# EAGLE design Attiny bot (EAGLE 7.2.0)
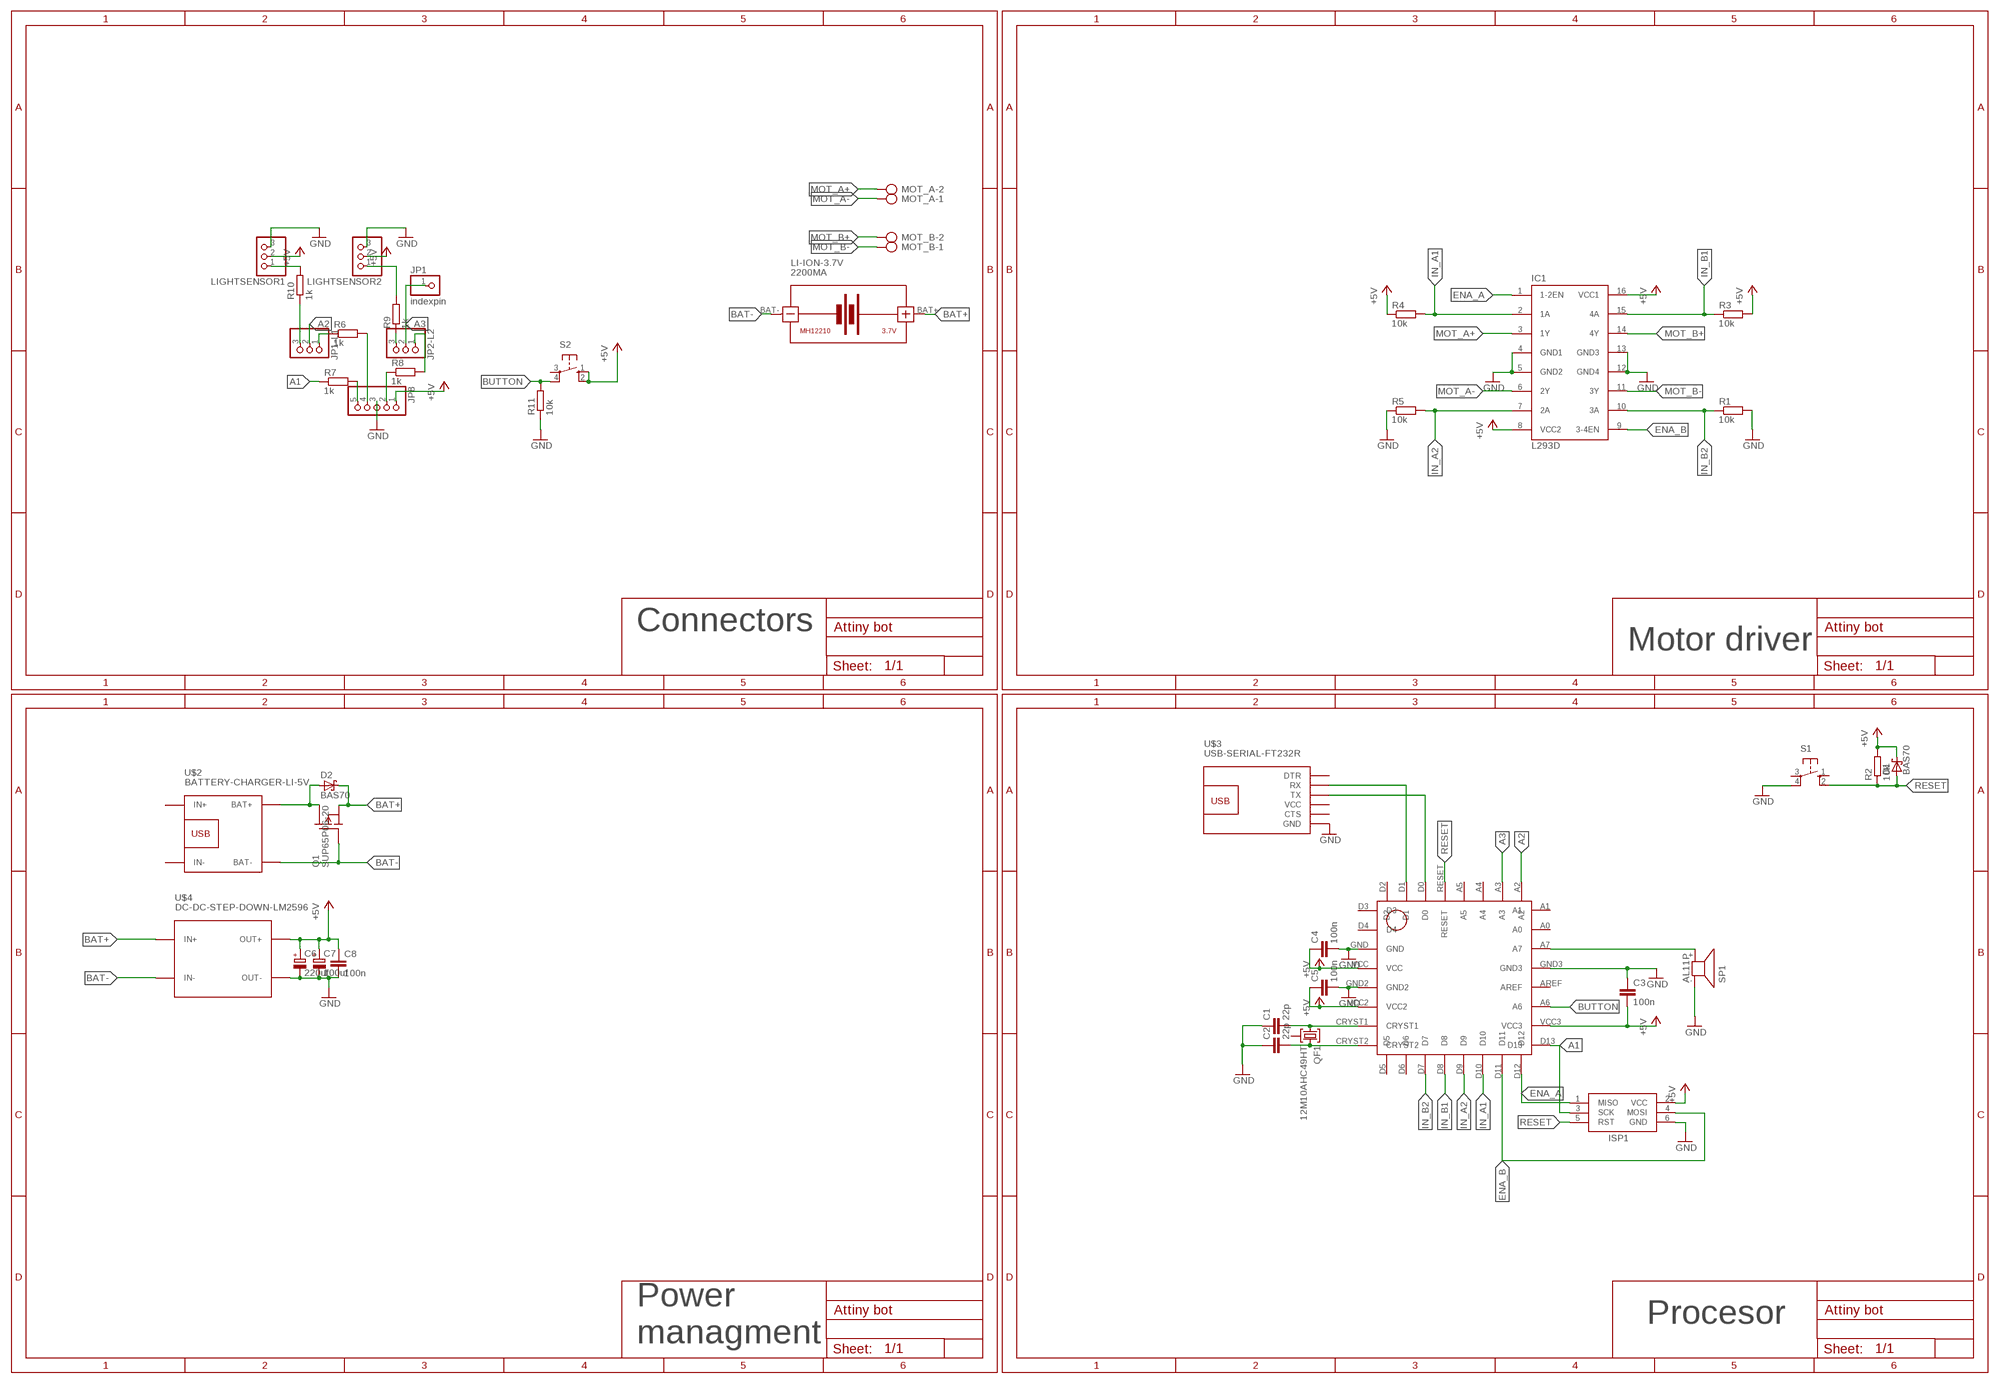
[diagram p0: schematic, sheet 1]

## Parts
C1  22p  C-EUC1206  [C1206]
C2  22p  C-EUC1206  [C1206]
C3  100n  C-EUC1206  [C1206]
C4  100n  C-EUC1206  [C1206]
C5  100n  C-EUC1206  [C1206]
C6  220uf  CPOL-EUE3.5-8  [E3,5-8]
C7  100uf  CPOL-EUE3.5-8  [E3,5-8]
C8  100n  C-EUC1206  [C1206]
D1  BAS70  [SOT23]
D2  BAS70  [SOT23]
IC1  L293D  [DIL16]
ISP1  AVRISP-6  [AVRISP]
JP1  indexpin  PINHD-1X1  [1X01]
JP1-L1  PINHD-1X3  [1X03]
JP2-L2  PINHD-1X3  [1X03]
JP8  PINHD-1X5  [1X05]
LI-ION-3.7V  2200MA  BATTERY-LI-MH12210  [BATTERY-LI-MH12210]
LIGHTSENSOR1  PINHD-1X3  [1X03]
LIGHTSENSOR2  PINHD-1X3  [1X03]
MOT_A  AK500/2  [AK500/2]
MOT_B  AK500/2  [AK500/2]
Q1  SUP65P06-20  [TO220]
QF1  12M10AHC49HT  [HC49U]
R1  10k  R-EU_R1206  [R1206]
R2  10k  R-EU_R1206  [R1206]
R3  10k  R-EU_R1206  [R1206]
R4  10k  R-EU_R1206  [R1206]
R5  10k  R-EU_R1206  [R1206]
R6  1k  R-EU_R1206  [R1206]
R7  1k  R-EU_R1206  [R1206]
R8  1k  R-EU_R1206  [R1206]
R9  1k  R-EU_R1206  [R1206]
R10  1k  R-EU_R1206  [R1206]
R11  10k  R-EU_R1206  [R1206]
S1  10-XX  [B3F-10XX]
S2  10-XX  [B3F-10XX]
SP1  AL11P  [AL11P]
U$1  PROCESSOR  [PROCESOR]
U$2  BATTERY-CHARGER-LI-5V  [BATTERY-CHARGER-LI-5V]
U$3  USB-SERIAL-FT232R  [USB-SERIAL-FT232R]
U$4  DC-DC-STEP-DOWN-LM2596  [DC-DC-STEP-DOWN-LM2596]

## Nets
+5V: C3.2 C4.1 C5.1 C6.+ C7.+ C8.1 D1.3(C) IC1.8(VCC2) IC1.16(VCC1) ISP1.2(VCC) JP8.1 LIGHTSENSOR1.2 LIGHTSENSOR2.2 R2.2 R3.2 R4.1 S2.1(S) S2.2(S1) U$1.VCC U$1.VCC2 U$1.VCC3 U$4.OUT+
A1: ISP1.3(SCK) R7.1 U$1.D13
A2: JP1-L1.2 U$1.A2
A3: JP1.1 JP2-L2.2 U$1.A3
BAT+: D2.3(C) LI-ION-3.7V.BAT+ Q1.3(S) U$4.IN+
BAT-: LI-ION-3.7V.BAT- Q1.1(G) U$2.BAT- U$4.IN-
BUTTON: R11.2 S2.4(P1) U$1.A6
ENA_A: IC1.1(1-2EN) ISP1.1(MISO) U$1.D12
ENA_B: IC1.9(3-4EN) ISP1.4(MOSI) U$1.D11
GND: C1.1 C2.1 C3.1 C4.2 C5.2 C6.- C7.- C8.2 IC1.4(GND1) IC1.5(GND2) IC1.12(GND4) IC1.13(GND3) ISP1.6(GND) JP8.3 LIGHTSENSOR1.3 LIGHTSENSOR2.3 R1.2 R5.1 R11.1 S1.4(P1) SP1.- U$1.GND U$1.GND2 U$1.GND3 U$3.6(GND) U$4.OUT-
IN_A1: IC1.2(1A) R4.2 U$1.D10
IN_A2: IC1.7(2A) R5.2 U$1.D9
IN_B1: IC1.15(4A) R3.1 U$1.D8
IN_B2: IC1.10(3A) R1.1 U$1.D7
MOT_A+: IC1.3(1Y) MOT_A.2
MOT_A-: IC1.6(2Y) MOT_A.1
MOT_B+: IC1.14(4Y) MOT_B.2
MOT_B-: IC1.11(3Y) MOT_B.1
N$1: JP1-L1.1 R6.1
N$2: JP8.2 R8.1
N$3: C2.2 QF1.3 U$1.CRYST2
N$4: C1.2 QF1.1 U$1.CRYST1
N$6: LIGHTSENSOR2.1 R9.2
N$7: U$1.D1 U$3.2(RX)
N$8: LIGHTSENSOR1.1 R10.2
N$9: JP2-L2.3 R9.1
N$10: JP8.5 R7.2
N$11: JP8.4 R6.2
N$12: JP2-L2.1 R8.2
N$13: JP1-L1.3 R10.1
N$14: D2.1(A) Q1.2(D) U$2.BAT+
N$15: SP1.+ U$1.A7
N$16: U$1.D0 U$3.3(TX)
RESET: D1.1(A) ISP1.5(RST) R2.1 S1.2(S1) U$1.RESET
Unconnected: QF1.2 S1.1(S) S1.3(P) S2.3(P) U$1.A0 U$1.A1 U$1.A4 U$1.A5 U$1.AREF U$1.D2 U$1.D3 U$1.D4 U$1.D5 U$1.D6 U$2.IN+ U$2.IN- U$3.1(DTR) U$3.5(CTS)

## Notes on the sheet
- Connectors
- Motor driver
- Procesor
- Power
  managment

## Power pins joined to a net without a drawn wire
VCC: U$3.4(VCC)

## Library data of the parts
C1-C5 C8 = rcl:C-EU: CAPACITOR, European symbol
C6 C7 = rcl:CPOL-EU: POLARIZED CAPACITOR, European symbol
D1 D2 = diode:BAS70: Silicon Schottky Diodes General-purpose diode for high-speed switching
IC1 = st-microelectronics:L293D: PUSH-PULL 4 CHANNEL DRIVER; MPN: L293D; OC_FARNELL: 9589619; OC_NEWARK: 56P8249
ISP1 = adafruit:AVRISP: AVR ISP HEADER Standard 6 pin header for AVR programming
JP1 = pinhead:PINHD-1X1: PIN HEADER
JP1-L1 JP2-L2 LIGHTSENSOR1 LIGHTSENSOR2 = pinhead:PINHD-1X3: PIN HEADER
JP8 = pinhead:PINHD-1X5: PIN HEADER
LI-ION-3.7V = diy-modules:BATTERY-LI-MH12210: Lithium-Ion MH12210 Rechargeable Battery Panasonic NCR18650PF battery datasheet available here: https://industrial.panasonic.com/cdbs/www-data/pdf2/ACI4000/ACI4000C12.pdf Click here to find device on ebay.com <http://www.ebay.com/sch/ncr18650b+battery>
MOT_A MOT_B = con-ptr500:AK500/2: CONNECTOR; OC_FARNELL: unknown; OC_NEWARK: unknown
Q1 = transistor-fet+irf7201:SUP65P06-20: P-Channel Enhancement MOSFET -60V; 60A; 0,020Ohm
QF1 = crystal:12M10AHC49HT: Monolithic Crystal Filters Source: www.vanlong.com; OC_FARNELL: unknown; OC_NEWARK: unknown
R1-R11 = rcl:R-EU_: RESISTOR, European symbol
S1 S2 = switch-omron:10-XX: OMRON SWITCH; MPN: B3F-1000; OC_FARNELL: 176432; OC_NEWARK: 36M3542
SP1 = buzzer:AL11P: SPEAKER Source: Buerklin; OC_FARNELL: unknown; OC_NEWARK: unknown
U$1 = PROCESSOR:PROCESSOR
U$2 = diy-modules:BATTERY-CHARGER-LI-5V: Lithium Battery 5V Charger More details available here: http://www.buildcircuit.com/how-to-use-micro-usb-5v-1a-lithium-battery-charging-board-charger-module/ Click here to find device on ebay.com <http://www.ebay.com/sch/tp4056+charger+usb>
U$3 = diy-modules:USB-SERIAL-FT232R: USB to Serial UART Converter based on FT232R chip More information about FT232R chip is available here: http://www.ftdichip.com/Products/ICs/FT232R.htm Click here to find device on ebay.com <http://www.ebay.com/sch/ft232rl+arduino+download+max232>
U$4 = diy-modules:DC-DC-STEP-DOWN-LM2596: DC/DC Step-Down Regulator based on LM2596-ADJ chip LM2596 datasheet available here: http://www.ti.com/lit/ds/symlink/lm2596.pdf Click here to find device on ebay.com <http://www.ebay.com/sch/lm2596+power+regulator>

## Board
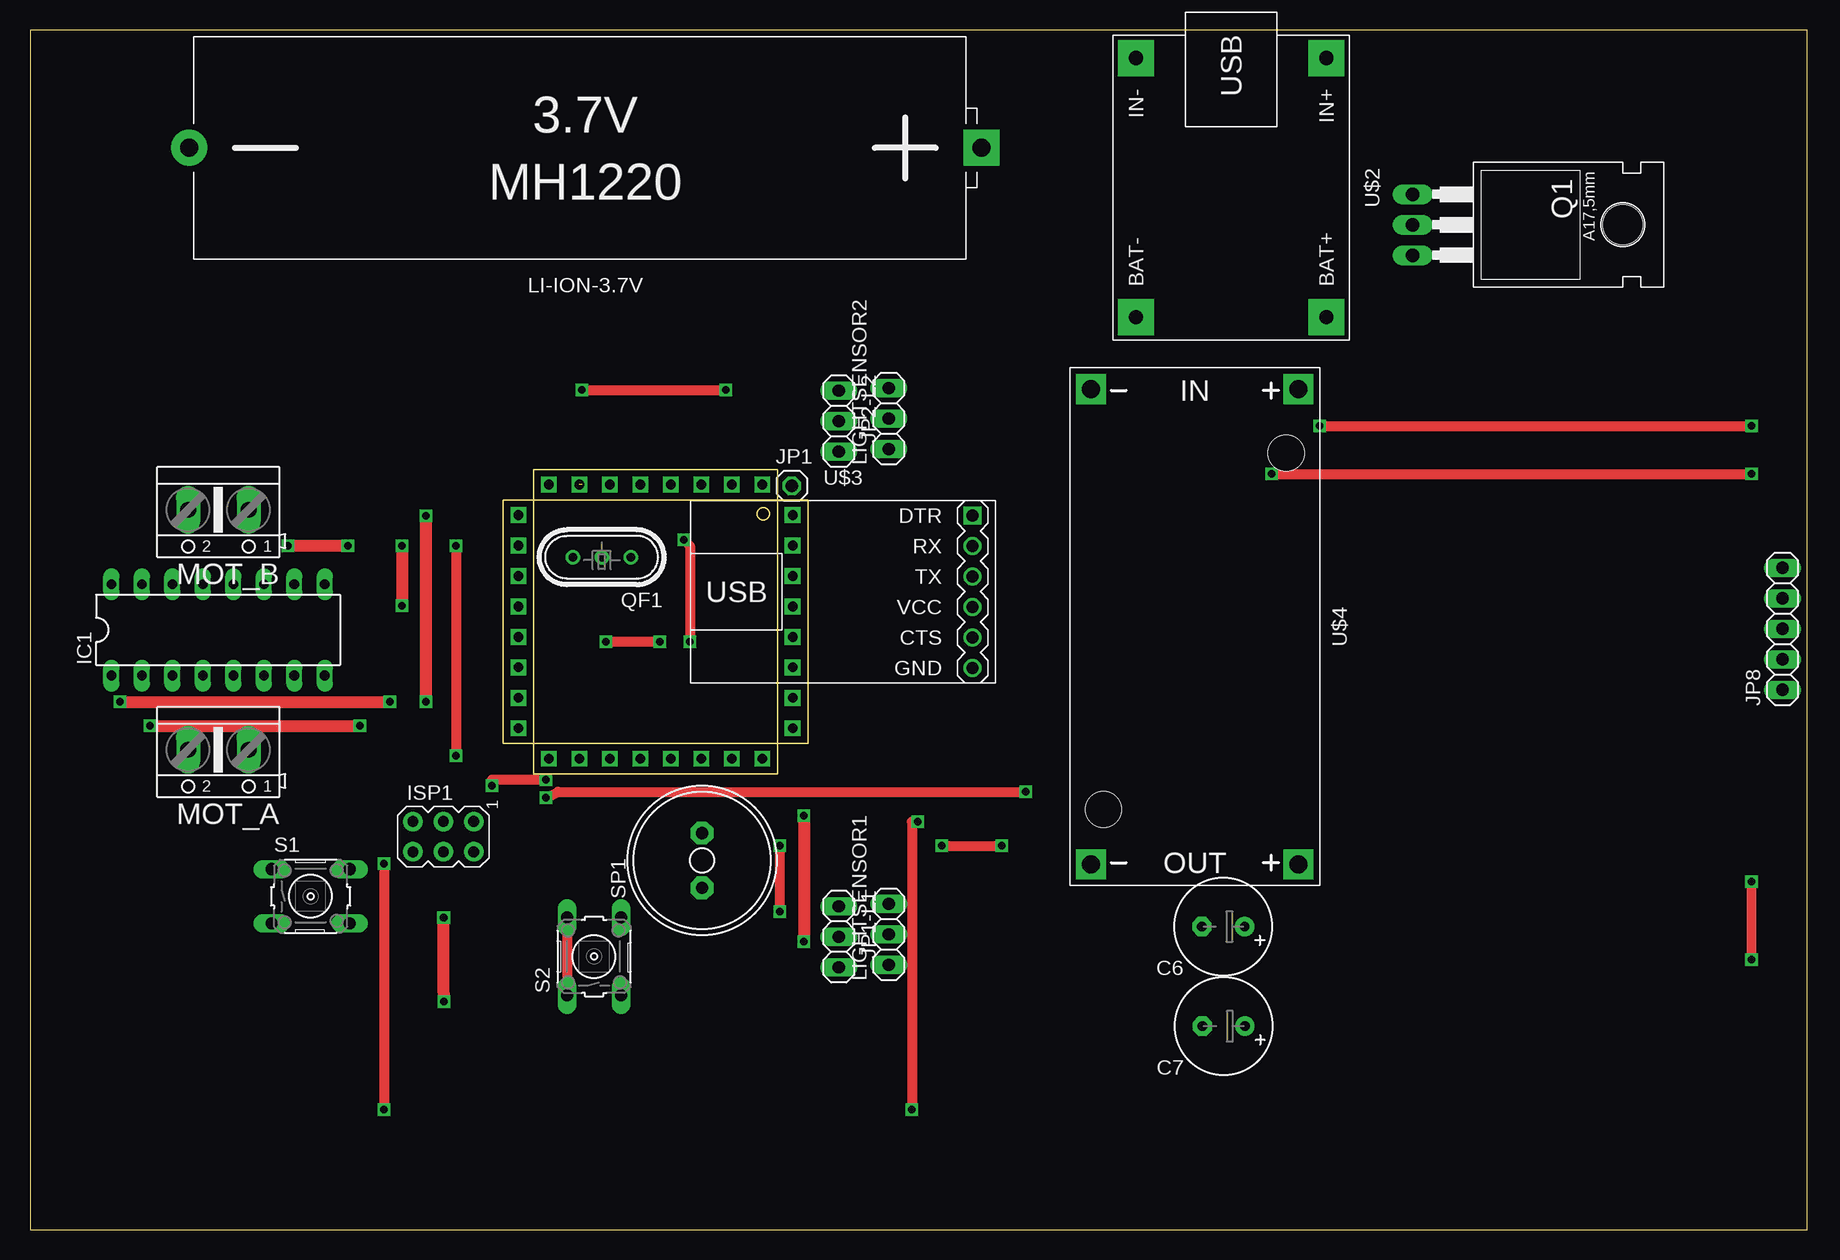
[diagram p1: board, top side]
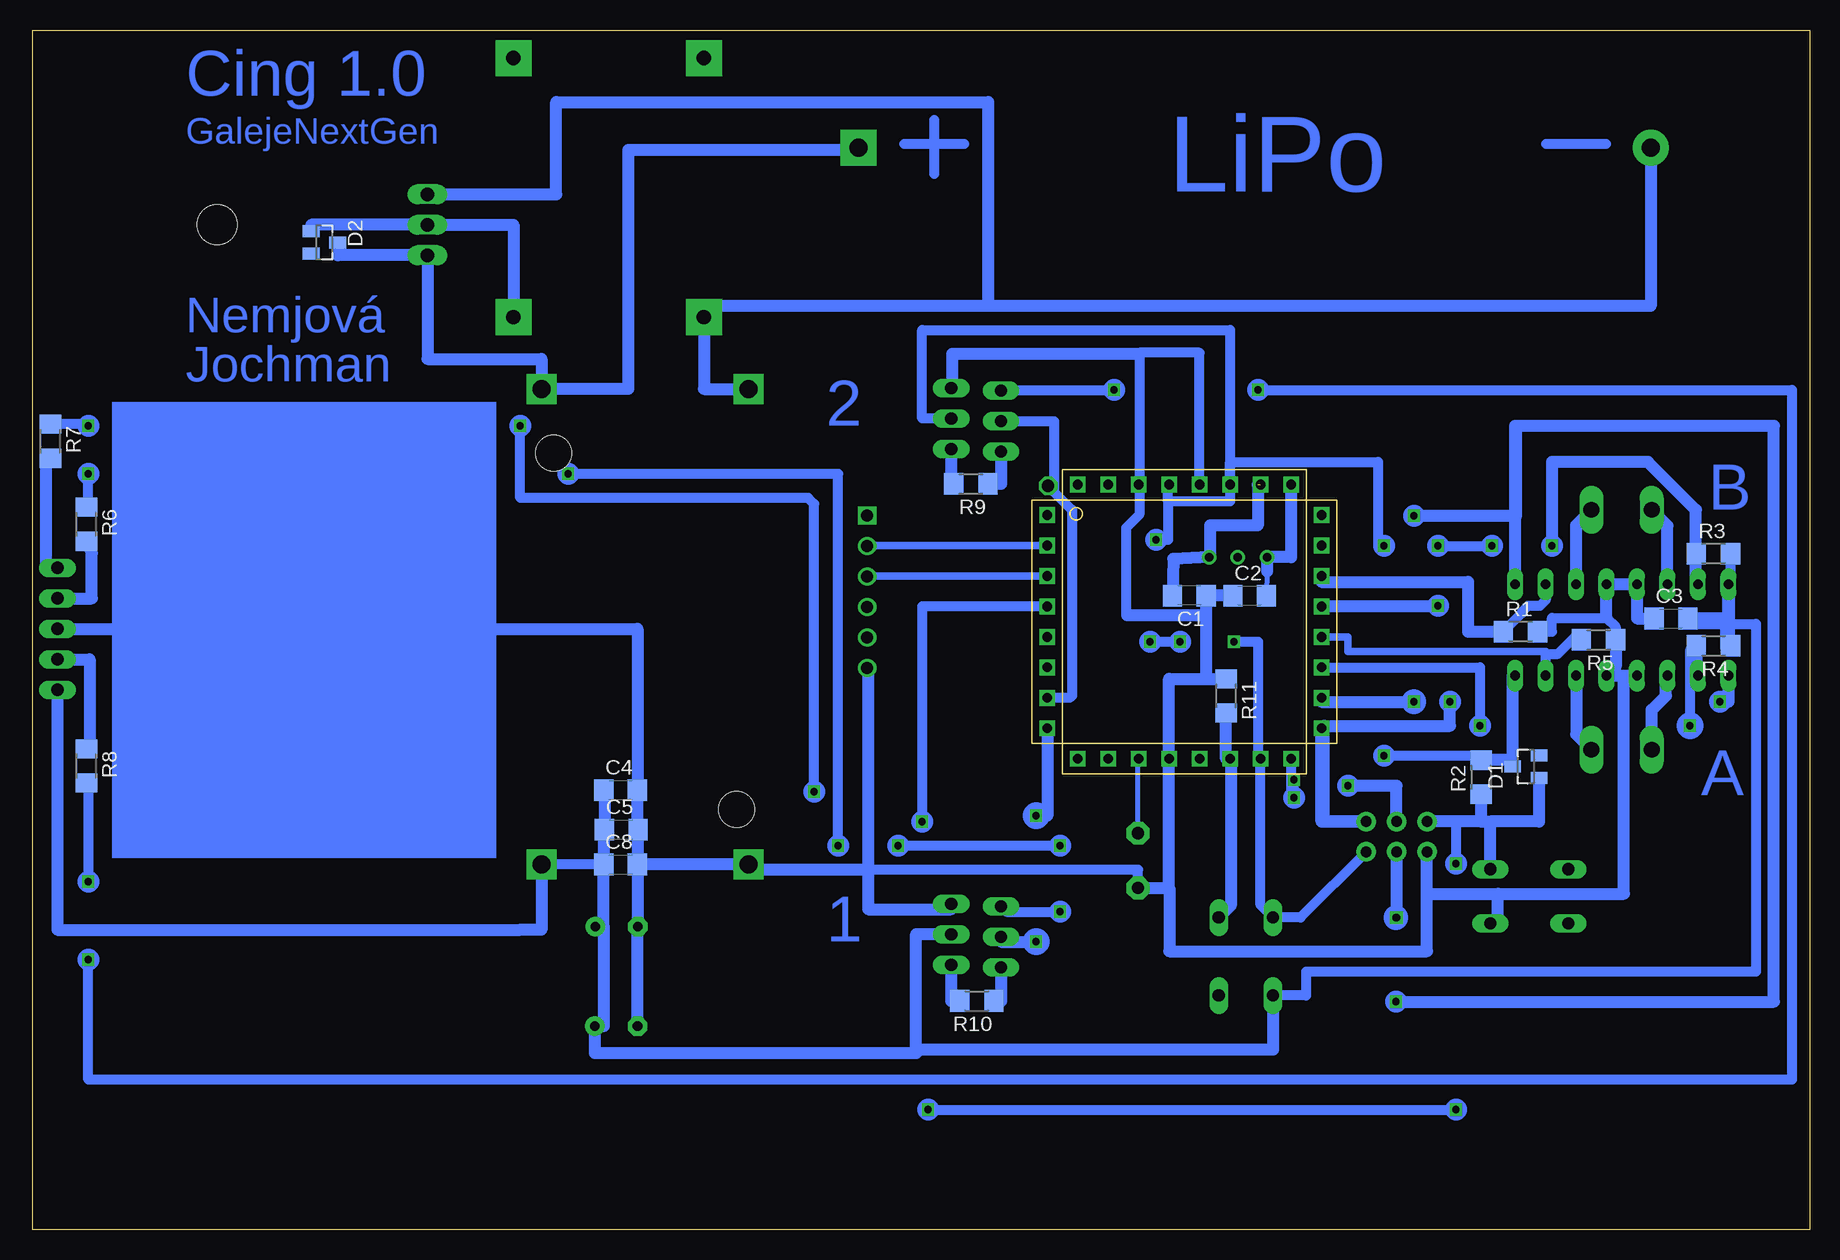
[diagram p2: board, bottom side, seen from below]

Size 148.14 x 100 mm. Coordinates in mm from the lower left corner, seen from the top.
Outline: 0,0 148.14,0 148.14,100 0,100 0,0
Copper layers (1*16): Top 0.035mm / dielectric 1.5mm / Bottom 0.035mm
Design rules "default": minimum track width 10mil, minimum drill 24mil, track to track 8mil, track to pad 8mil, pad to pad 8mil, via to via 8mil, smd to smd 8mil, copper to edge 40mil, drill to drill 8mil, minimum pad ring 10mil, minimum via ring 8mil, stop-mask expansion 4mil, vias tented up to drill 0mil, thermal gap 10mil

### Footprints (pad centres in the part's own frame; a part is rotated, then mirrored left to right if it is on the bottom)
C1206 = smd 1.6 x 1.8: 1 -1.4,0; 2 1.4,0
E3,5-8 = drill 0.813 pad 1.6: + -1.778,0 | drill 0.813 pad 1.6 octagon: - 1.778,0
SOT23 = smd 1 x 1.4: 1 -0.95,-1.1; 2 0.95,-1.1; 3 0,1.1
DIL16 = drill 0.813 long: 1 -8.89,-3.81; 2 -6.35,-3.81; 3 -3.81,-3.81; 4 -1.27,-3.81; 5 1.27,-3.81; 6 3.81,-3.81; 7 6.35,-3.81; 8 8.89,-3.81; 9 8.89,3.81; 10 6.35,3.81; 11 3.81,3.81; 12 1.27,3.81; 13 -1.27,3.81; 14 -3.81,3.81; 15 -6.35,3.81; 16 -8.89,3.81
AVRISP = drill 0.9 pad 1.626: 1 -1.27,2.54; 2 1.27,2.54; 3 -1.27,0; 4 1.27,0; 5 -1.27,-2.54; 6 1.27,-2.54
1X01 = drill 1.016 octagon: 1 0,0
1X03 = drill 1.016 long: 1 -2.54,0; 2 0,0; 3 2.54,0
1X05 = drill 1.016 long: 1 -5.08,0; 2 -2.54,0; 3 0,0; 4 2.54,0; 5 5.08,0
BATTERY-LI-MH12210 = drill 1.5 pad 3 square: BAT+ -33.02,0 | drill 1.5 pad 3: BAT- 33.02,0
AK500/2 = drill 1.321 long: 1 -2.515,0; 2 2.515,0
TO220 = drill 1.118 long: 1 -2.54,-6.35; 2 0,-6.35; 3 2.54,-6.35 | hole 3.302: 0,11.176
HC49U = drill 0.7 pad 1.2: 1 -2.413,0; 2 -0.027,0; 3 2.413,0
R1206 = smd 1.6 x 1.803: 1 -1.422,0; 2 1.422,0
B3F-10XX = drill 1.016 long: 1 -3.251,2.261; 2 3.251,2.261; 3 -3.251,-2.261; 4 3.251,-2.261
AL11P = drill 1.016 pad 1.905 octagon: + 2.286,0; - -2.286,0
PROCESOR = drill 0.8 square: A0 11.43,6.35; A1 11.43,8.89; A2 8.89,11.43; A3 6.35,11.43; A4 3.81,11.43; A5 1.27,11.43; A6 11.43,-3.81; A7 11.43,3.81; AREF 11.43,-1.27; CRYST1 -11.43,-6.35; CRYST2 -11.43,-8.89; D0 -3.81,11.43; D1 -6.35,11.43; D2 -8.89,11.43; D3 -11.43,8.89; D4 -11.43,6.35; D5 -8.89,-11.43; D6 -6.35,-11.43; D7 -3.81,-11.43; D8 -1.27,-11.43; D9 1.27,-11.43; D10 3.81,-11.43; D11 6.35,-11.43; D12 8.89,-11.43; D13 11.43,-8.89; GND -11.43,3.81; GND2 -11.43,-1.27; GND3 11.43,1.27; RESET -1.27,11.43; VCC -11.43,1.27; VCC2 -11.43,-3.81; VCC3 11.43,-6.35
BATTERY-CHARGER-LI-5V = drill 1.2 pad 3 square: BAT+ 10.795,8.255; BAT- 10.795,-7.62; IN+ -10.795,8.255; IN- -10.795,-7.62
USB-SERIAL-FT232R = drill 1 square: 1 10.795,6.35 | drill 1: 2 10.795,3.81; 3 10.795,1.27; 4 10.795,-1.27; 5 10.795,-3.81; 6 10.795,-6.35
DC-DC-STEP-DOWN-LM2596 = drill 1.5 pad 2.5 square: IN+ -19.812,8.636; IN- -19.812,-8.636; OUT+ 19.812,8.636; OUT- 19.812,-8.636 | hole 3: -14.478,7.62; 15.24,-7.62

### Placement (x,y rotation side)
C1  51.73,52.84 180 bottom
C2  46.7,52.84 0 bottom
C3  11.59,50.94 0 bottom
C4  99.14,36.64 0 bottom
C5  99.09,33.34 0 bottom
C6  99.47,25.25 180 top
C7  99.5,16.95 180 top
C8  99.14,30.44 0 bottom
D1  23.68,38.59 90 bottom
D2  123.82,82.29 270 bottom
IC1  15.68,49.99 0 top
ISP1  34.45,32.75 270 top
JP1  63.5,62 0 top
JP1-L1  67.42,24.4 270 top
JP2-L2  67.42,67.39 270 top
JP8  146.08,50.08 90 top
LI-ION-3.7V  46.29,90.17 180 top
LIGHTSENSOR1  71.58,24.61 90 top
LIGHTSENSOR2  71.58,67.61 90 top
MOT_A  15.7,40 180 top
MOT_B  15.7,60 180 top
Q1  121.59,83.76 270 top
QF1  47.66,56.05 180 top
R1  24.12,49.84 0 bottom
R2  27.42,37.71 90 bottom
R3  8.04,56.34 0 bottom
R4  8.04,48.66 180 bottom
R5  17.62,49.16 180 bottom
R6  143.66,58.8 270 bottom
R7  146.66,65.72 270 bottom
R8  143.66,38.64 270 bottom
R9  69.94,62.16 180 bottom
R10  69.44,19.06 180 bottom
R11  48.66,44.48 270 bottom
S1  23.39,27.78 0 top
S2  47.02,22.76 90 top
SP1  56.01,30.76 90 top
U$1  52.14,50.67 270 top
U$2  99.81,86.86 270 top
U$3  67.78,53.17 0 top
U$4  97.09,50.26 270 top

### Tracks (layer width: path | path; a pad name or v marks a point on that pad's centre or on a via)
+5V  (via drill 0.6)
  Top 0.813: S2.2 S2.1 44.76,19 | v35.5,57 v35.5,39.5 | v52.5,49 v48,49 | v54.5,57.5 55,57 v55,49
  Bottom 0.406: 53.5,62.1 U$1.VCC | C4.1 100.49,36.64 | C5.1 100.54,33.34 | C6.+ 101.28,25.25
  Bottom 0.813: U$1.VCC2 48.33,60.7 53.5,60.7 | 53.5,60.7 53.5,62.1 | R4.1 6.62,53.63 IC1.16 6.62,53.97 R3.2 | C3.2 10.19,50.5 4.5,50.5 4.5,21.5 42,21.5 42,19.51 S2.1 | R2.2 27.42,39.5 v35.5,39.5 | U$1.VCC2 48.33,64 36,64 36,57 v35.5,57 | v48,49 46,49 46,39.5 45.79,39.29 U$1.VCC3 45.79,27.04 S2.2 42.46,26.01 ISP1.2 | 53.5,60.7 53.5,57.5 v54.5,57.5 | v52.5,49 v55,49 | LIGHTSENSOR2.2 74,67.61 74,75 48.33,75 U$1.VCC2 | C8.1 U$4.OUT+
  Bottom 1.016: 100.49,36.64 C5.1 | 100.54,33.34 C8.1 100.54,25.25 | C6.+ 100.54,25.25 | LIGHTSENSOR1.2 74.5,24.61 74.5,15 | JP8.1 146.08,25 107.5,25 105.73,25 U$4.OUT+ | IC1.16 6.79,50.94 C3.2 10.19,51 7,51 7,48.5 6.5,48.5 | D1.3 24.78,39.13 | 24.78,39.13 R2.2 | 24.78,39.13 24.78,46.18 IC1.8 | S2.1 44.76,15 74.5,15 | 100.54,25.25 100.54,16.95 C7.+ 101.28,14.7 74.5,14.7 74.5,15
A1  (via drill 0.6)
  Top 0.813: v43,36 44,36.5 v83,36.5 | v107.5,67 v143.5,67 | v43,37.5 38.5,37.5 v38.5,37
  Bottom 0.813: U$1.D13 43.25,36 v43,36 v43,37.5 | v83,36.5 83,60.5 83.5,61 107.5,61 v107.5,67 | v143.5,67 143.64,67.14 R7.1
  Bottom 1.016: ISP1.3 34.45,37 v38.5,37
A2  (via drill 0.6)
  Top 1.016: v64.5,34.5 v64.5,24
  Bottom 1.016: U$1.A2 63.57,34.5 v64.5,34.5 | JP1-L1.2 67.42,24 v64.5,24
A3
  Bottom 0.813: JP2-L2.2 63,67.39 63,62 | 63,62 63,61.5 61.5,60 61.5,44.5 61.68,44.32 U$1.A3 | JP1.1 63,62
BAT+
  Bottom 1.016: LI-ION-3.7V.BAT+ 79.31,90 98.5,90 98.5,70.07 U$4.IN+ 105.73,72.57 115.24,72.57 Q1.3 122.72,81.22 D2.3
BAT-
  Bottom 1.016: LI-ION-3.7V.BAT- 13.27,77 68.5,77 | 68.5,77 92.5,77 92.5,76.06 U$2.BAT- 92.19,70.07 U$4.IN- | Q1.1 104.5,86.3 104.5,94 68.5,94 68.5,77
BUTTON
  Bottom 0.406: U$1.A6 48.28,39.24
  Bottom 1.016: U$1.A6 48.66,39.24 R11.2 | 48.28,39.24 48.28,27.01 S2.4
ENA_A  (via drill 0.6)
  Top 1.016: v7.5,44 v30,44
  Bottom 1.016: U$1.D12 40.71,34.02 ISP1.1 36.99,34 40.5,34 40.5,42 30,42 v30,44 | IC1.1 6.79,44 v7.5,44
ENA_B  (via drill 0.6)
  Top 1.016: v33,44 v33,59.5 | v34.45,26 34.45,20 v34.5,19
  Bottom 1.016: U$1.D11 40.71,44 v33,44 | IC1.9 24.57,67 24.5,67 | v34.5,19 3,19 3,67 24.5,67 | 24.5,67 24.5,59.5 v33,59.5 | ISP1.4 v34.45,26 v34.5,26
GND
  Bottom 0.406: 55.9,62.1 U$1.GND | 53.41,28.47 53.4,28.47 | C8.2 | 97.72,30.44 97.69,30.44 | C5.2 97.74,33.34
  Bottom 0.61: ISP1.6 31.91,28 | 15.5,46.18 IC1.5 | 71.5,70.15 LIGHTSENSOR2.3
  Bottom 0.813: U$1.GND2 50.87,73.1 55.9,73.1 55.9,73 55.9,62.1 55.9,59.6 57,58.5 57,51.3 56.9,51.2 | R1.2 21.5,49.84 21.5,51 16.95,51 16.2,50.25 R5.1 | 16.2,46.93 IC1.5 | U$3.6 78.5,46.82 | SP1.- 56,30 78.5,30
  Bottom 1.016: C2.1 C1.1 50.33,51.2 | 50.33,51.2 56.9,51.2 | SP1.- 53.41,28.47 U$1.GND3 53.41,45.9 50.33,45.9 | LIGHTSENSOR1.3 71.58,26.7 78.5,26.7 78.5,30 | 53.4,28.47 53.4,23.2 31.91,23.2 ISP1.6 | U$4.OUT- 89,30.45 | 89,30.45 C8.2 | 97.69,30.44 C5.2 | 97.74,33.34 C4.2 97.74,50.08 JP8.3 | 50.33,51.2 50.33,45.9 | 50.33,45.9 R11.1 | 16.95,51 IC1.12 IC1.13 14.41,50.94 C3.1 | R5.1 16.2,46.93 | IC1.5 IC1.4 | 31.91,28 26,28 | 26,28 15.5,28 15.5,46.18 | 55.9,73 71.5,73 71.5,70.15 | C7.- 97.72,25.25 | C8.2 97.72,30.44 97.72,25.25 | 97.72,25.25 C6.- | 78.5,46.82 78.5,30 | 78.5,30 88.55,30 arc90 89,30.45 | S1.4 26,25.52 26,28
  pour Bottom (hatched): 109.5,69 141.5,69 141.5,31 109.5,31
IN_A1  (via drill 0.6)
  Top 1.016: v10,42 v27.5,42
  Bottom 0.813: IC1.2 9.33,48.53 R4.2 arc-90 10,48.12 v10,42 | U$1.D10 27.5,46.86 v27.5,42
IN_A2
  Bottom 0.61: IC1.7 22.03,48.2 38.5,48.2 38.5,49.4 U$1.D9
  Bottom 0.813: R5.2 19.38,49.5 19.5,49.5 21,48 22,48 22.03,47.97 IC1.7
IN_B1  (via drill 0.6)
  Top 1.016: v26.5,57 v21.5,57 | v31,57 v31,52
  Bottom 0.813: R3.1 9.46,53.93 IC1.15 | v31,57 v26.5,57
  Bottom 1.016: 9.46,53.93 arc90 9.5,53.97 9.5,60 13.5,64 21.5,64 v21.5,57 | U$1.D8 40.71,52 v31,52
IN_B2
  Bottom 0.813: IC1.10 22.03,52.47 22.5,52 23.5,52 24,51.5 24,51.38 R1.1
  Bottom 1.016: U$1.D7 40.71,54 28.5,54 28.5,49.84 R1.1
MOT_A+
  Bottom 1.016: MOT_A.2 13.19,43.31 12,44.5 12,46.05 IC1.3
MOT_A-
  Bottom 1.016: IC1.6 19.49,41.27 MOT_A.1
MOT_B+
  Bottom 1.016: IC1.14 11.87,58.69 MOT_B.2
MOT_B-
  Bottom 1.016: IC1.11 19.49,58.73 MOT_B.1
N$1  (via drill 0.6)
  Top 0.813: v62.5,26.5 v62.5,32 | v76,32 v81,32 | v103.5,63 v143.5,63
  Bottom 0.813: JP1-L1.1 66.98,26.5 v62.5,26.5 | v62.5,32 v76,32 | v81,32 81,63 v103.5,63 | R6.1 143.5,60.38 v143.5,63
N$2
  Bottom 1.016: JP8.2 143.4,47.54 143.4,40.06 R8.1
N$3
  Bottom 0.406: 45.25,54.89 C2.2
  Bottom 1.016: U$1.CRYST2 43.25,56.05 QF1.3 45.25,54.89
N$4  (1 unrouted)
  Bottom 1.016: C1.2 53.07,55.9 QF1.1 50,56.05 50,58.7 46.02,58.7 46.02,62.1
N$5  (via drill 0.6)
  other vias: 43,37.5
N$6
  Bottom 1.016: LIGHTSENSOR2.1 71.58,62.16 R9.2
N$7
  Bottom 0.61: U$3.2 78.58,57.02 U$1.D1
N$8
  Bottom 1.016: LIGHTSENSOR1.1 71.58,19.06 R10.2
N$9
  Bottom 1.016: JP2-L2.3 67.42,62.16 R9.1
N$10
  Bottom 1.016: JP8.5 147,55.16 147,64.3 R7.2
N$11
  Bottom 1.016: JP8.4 143.2,52.62 143.2,56.38 R6.2
N$12  (via drill 0.6)
  Top 0.813: v46,70 v58,70 | v143.5,22.5 v143.5,29
  Bottom 0.813: 67.35,70 JP2-L2.1 58.07,69.93 v58,70 | v46,70 1.5,70 1.5,12.5 143.5,12.5 v143.5,22.5 | R8.2 143.5,37.06 v143.5,29
N$13
  Bottom 1.016: JP1-L1.3 67.42,19.06 R10.1
N$14
  Bottom 1.016: U$2.BAT+ 108.06,83.76 Q1.2 124.92,83.76 D2.1
N$15
  Bottom 0.406: SP1.+ 56.01,39.24 U$1.A7
N$16
  Bottom 0.61: U$3.3 78.58,54.48 U$1.D0
RESET  (via drill 0.6)
  Top 0.813: v29.5,30.5 v29.5,10 | v74,34 73.5,34 v73.5,10
  Bottom 0.813: ISP1.5 29.5,34.02 v29.5,30.5 | U$1.RESET 74,51.94 v74,34 | v73.5,10 v29.5,10
  Bottom 1.016: S1.2 26.64,34.02 | 27.42,34.02 ISP1.5 | D1.1 22.58,34.02 26.64,34.02 | R2.1 27.42,34.02 | 27.42,34.02 26.64,34.02
S$1
  Bottom 0.813: 17,90.5 22,90.5
S$2
  Bottom 0.813: 70.5,90.5 75.5,90.5
S$3
  Bottom 0.813: 73,92.5 73,88
(copper drawn outside any net)
  shapes: Bottom area x1, Bottom circle x38

### Text on the board
Bottom: Cing 1.0 | GalejeNextGen | LiPo | Nemjová | Jochman | 2 | B | A | 1